# Altium schematic sheet H-Bridge drive Sch.SchDoc
size A4
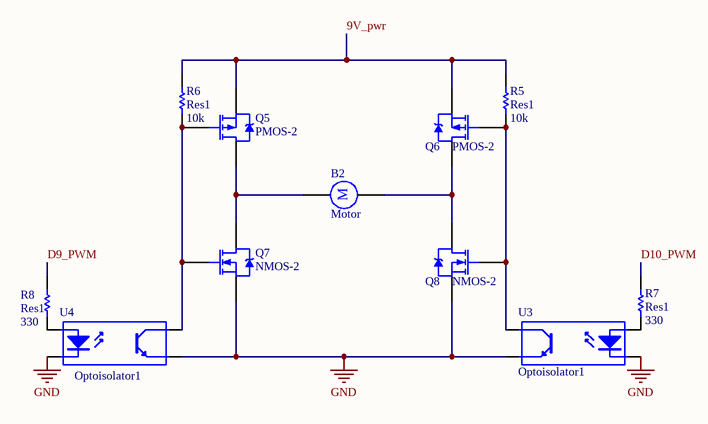
[diagram p0: H-Bridge drive Sch.SchDoc]

## Parts
B2  Motor  [HDR1X2]
Q5  PMOS-2  [TO-220AB]
Q6  PMOS-2  [TO-220AB]
Q7  NMOS-2  [TO-220AB]
Q8  NMOS-2  [TO-220AB]
R5  Res1  value 10k  [6-0805_N]
R6  Res1  value 10k  [6-0805_N]
R7  Res1  value 330  [6-0805_N]
R8  Res1  value 330  [6-0805_N]
U3  Optoisolator1  [DIP-4]
U4  Optoisolator1  [DIP-4]

## Nets
GND: Q7.3(S) Q8.3(S) U3.2(K) U3.3(E) U4.2(K) U4.3(E)
9V_pwr: Q5.3(S) Q6.3(S) R5.2 R6.2
D9_PWM: R8.2
D10_PWM: R7.2
NetB2_1: B2.1 Q5.2(D) Q7.2(D)
NetB2_2: B2.2 Q6.2(D) Q8.2(D)
NetQ5_1: Q5.1(G) Q7.1(G) R6.1 U4.4(C)
NetQ6_1: Q6.1(G) Q8.1(G) R5.1 U3.4(C)
NetR7_1: R7.1 U3.1(A)
NetR8_1: R8.1 U4.1(A)

## Notes on the sheet
- (in symbol Motor) M

## Library data of the parts
B2 = Motor: Motor, General Kind; Published: 24-Mar-1999; LatestRevisionDate: 17-Jul-2002; LatestRevisionNote: Re-released for DXP Platform.; PackageReference: RB5-10.5; Publisher: Altium Limited; PackageDescription: Capacitor (Radial); 2 Leads
Q5 Q6 = PMOS-2: P-Channel Power MOSFET; Note: Pin 4 not drawn and electrically connected to Pin 2.; Published: 8-Jun-2000; LatestRevisionDate: 17-Jul-2002; LatestRevisionNote: Re-released for DXP Platform.; DatasheetVersion: PD-9.390D; PackageVersion: Feb-1997; PackageReference: TO-220AB; Publisher: Altium Limited; PackageDescription: TO, Thru-Hole, Vertical, Heatsink Mounted; 3 In-Line Leads; Pitch 2.54 mm; ComponentLink1Description: Manufacturer Link; ComponentLink1URL: http://www.irf.com/
Q7 Q8 = NMOS-2: N-Channel Power MOSFET; Note: Pin 2 is electrically connected to pin 4.; Published: 8-Jun-2000; LatestRevisionDate: 17-Jul-2002; LatestRevisionNote: Re-released for DXP Platform.; DatasheetVersion: PD-9.814; PackageVersion: Feb-1997; PackageReference: TO-220AB; Publisher: Altium Limited; PackageDescription: TO, Thru-Hole, Vertical, Heatsink Mounted; 3 In-Line Leads; Pitch 2.54 mm; ComponentLink1Description: Manufacturer Link; ComponentLink1URL: http://www.irf.com/
R5-R8 = Res1: Resistor; Published: 8-Jun-2000; LatestRevisionDate: 17-Jul-2002; LatestRevisionNote: Re-released for DXP Platform.; PackageReference: AXIAL-0.3; Publisher: Altium Limited; PackageDescription: Axial Device, Thru-Hole; 2 Leads; 0.3 in Pin Spacing
U3 U4 = Optoisolator1: 4-Pin Phototransistor Optocoupler; Published: 24-Mar-1999; LatestRevisionDate: 04-Mar-2005; LatestRevisionNote: Sch pins 3 & 4 Swapped.; DatasheetVersion: Nov-2003; PackageReference: DIP-4; Publisher: Altium Limited